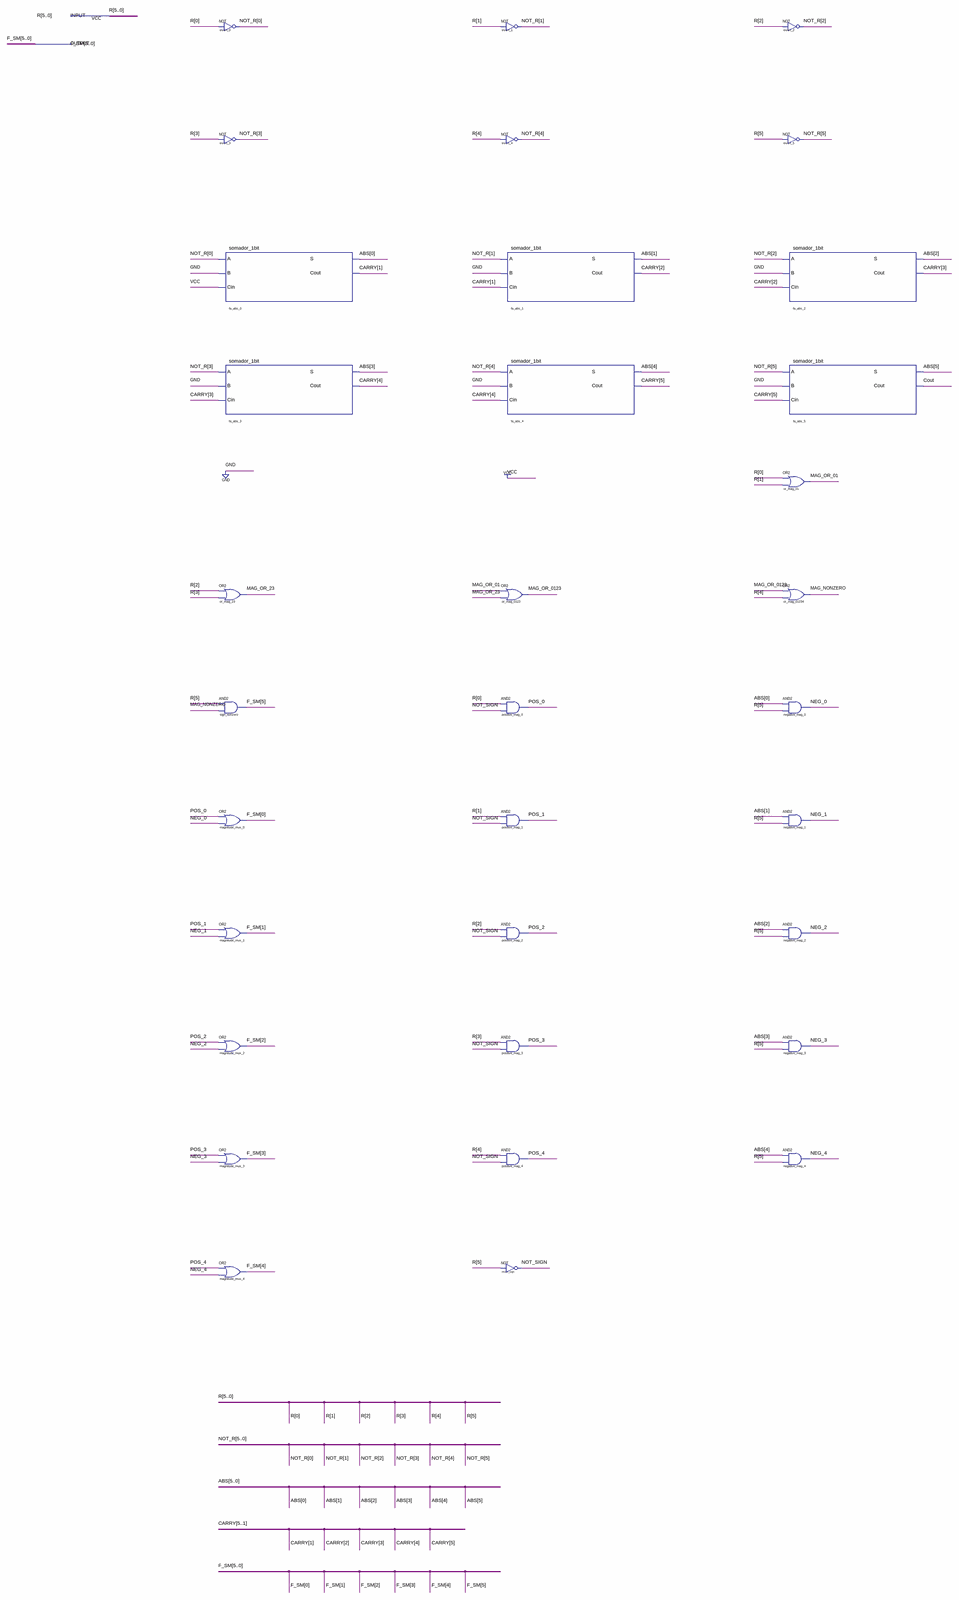
[diagram p0: schematic sheet, whole]
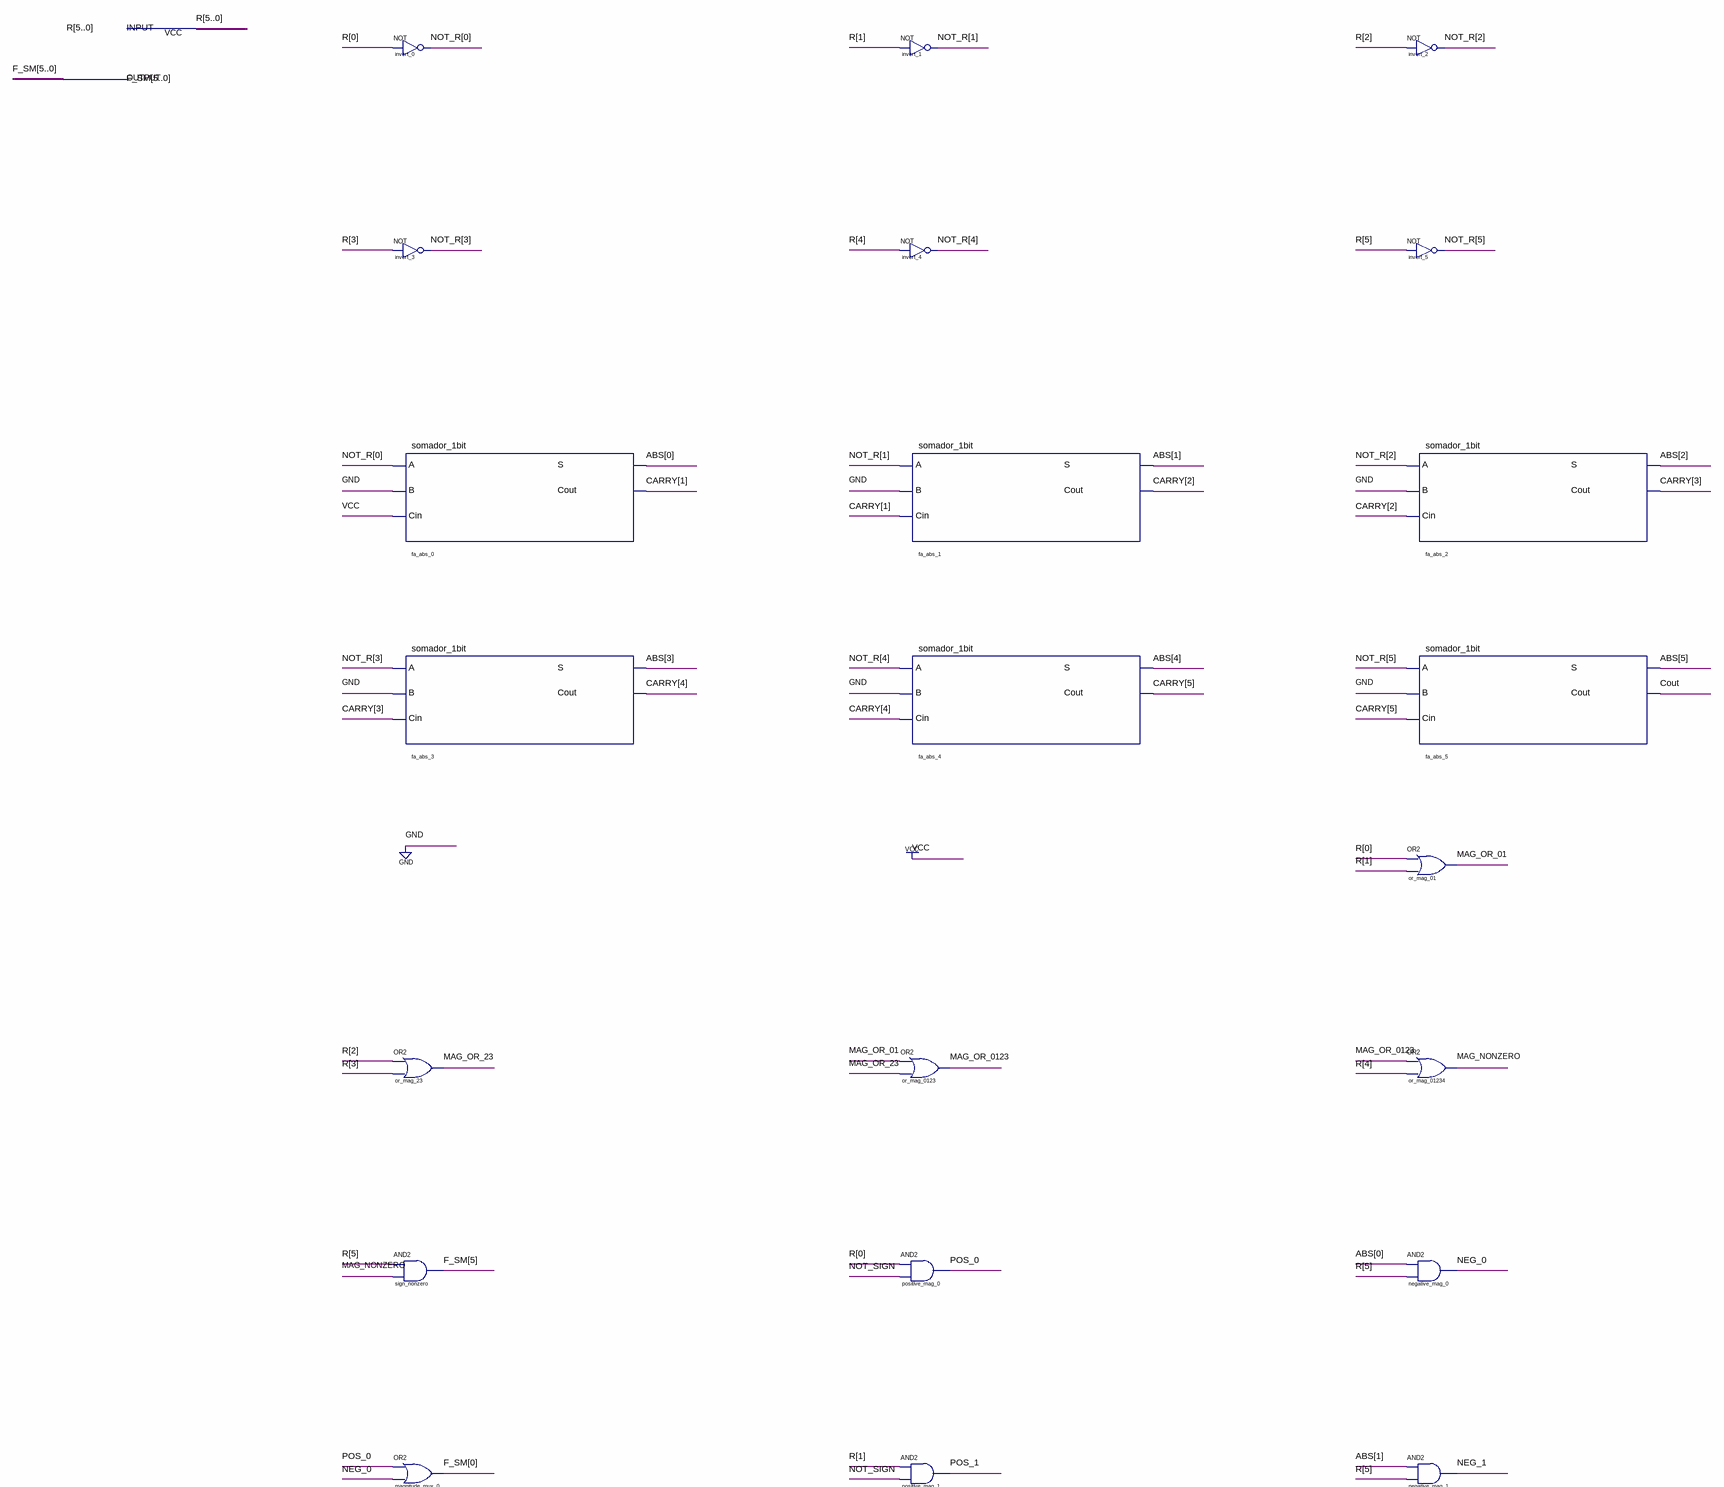
[diagram p1: schematic sheet, upper part]
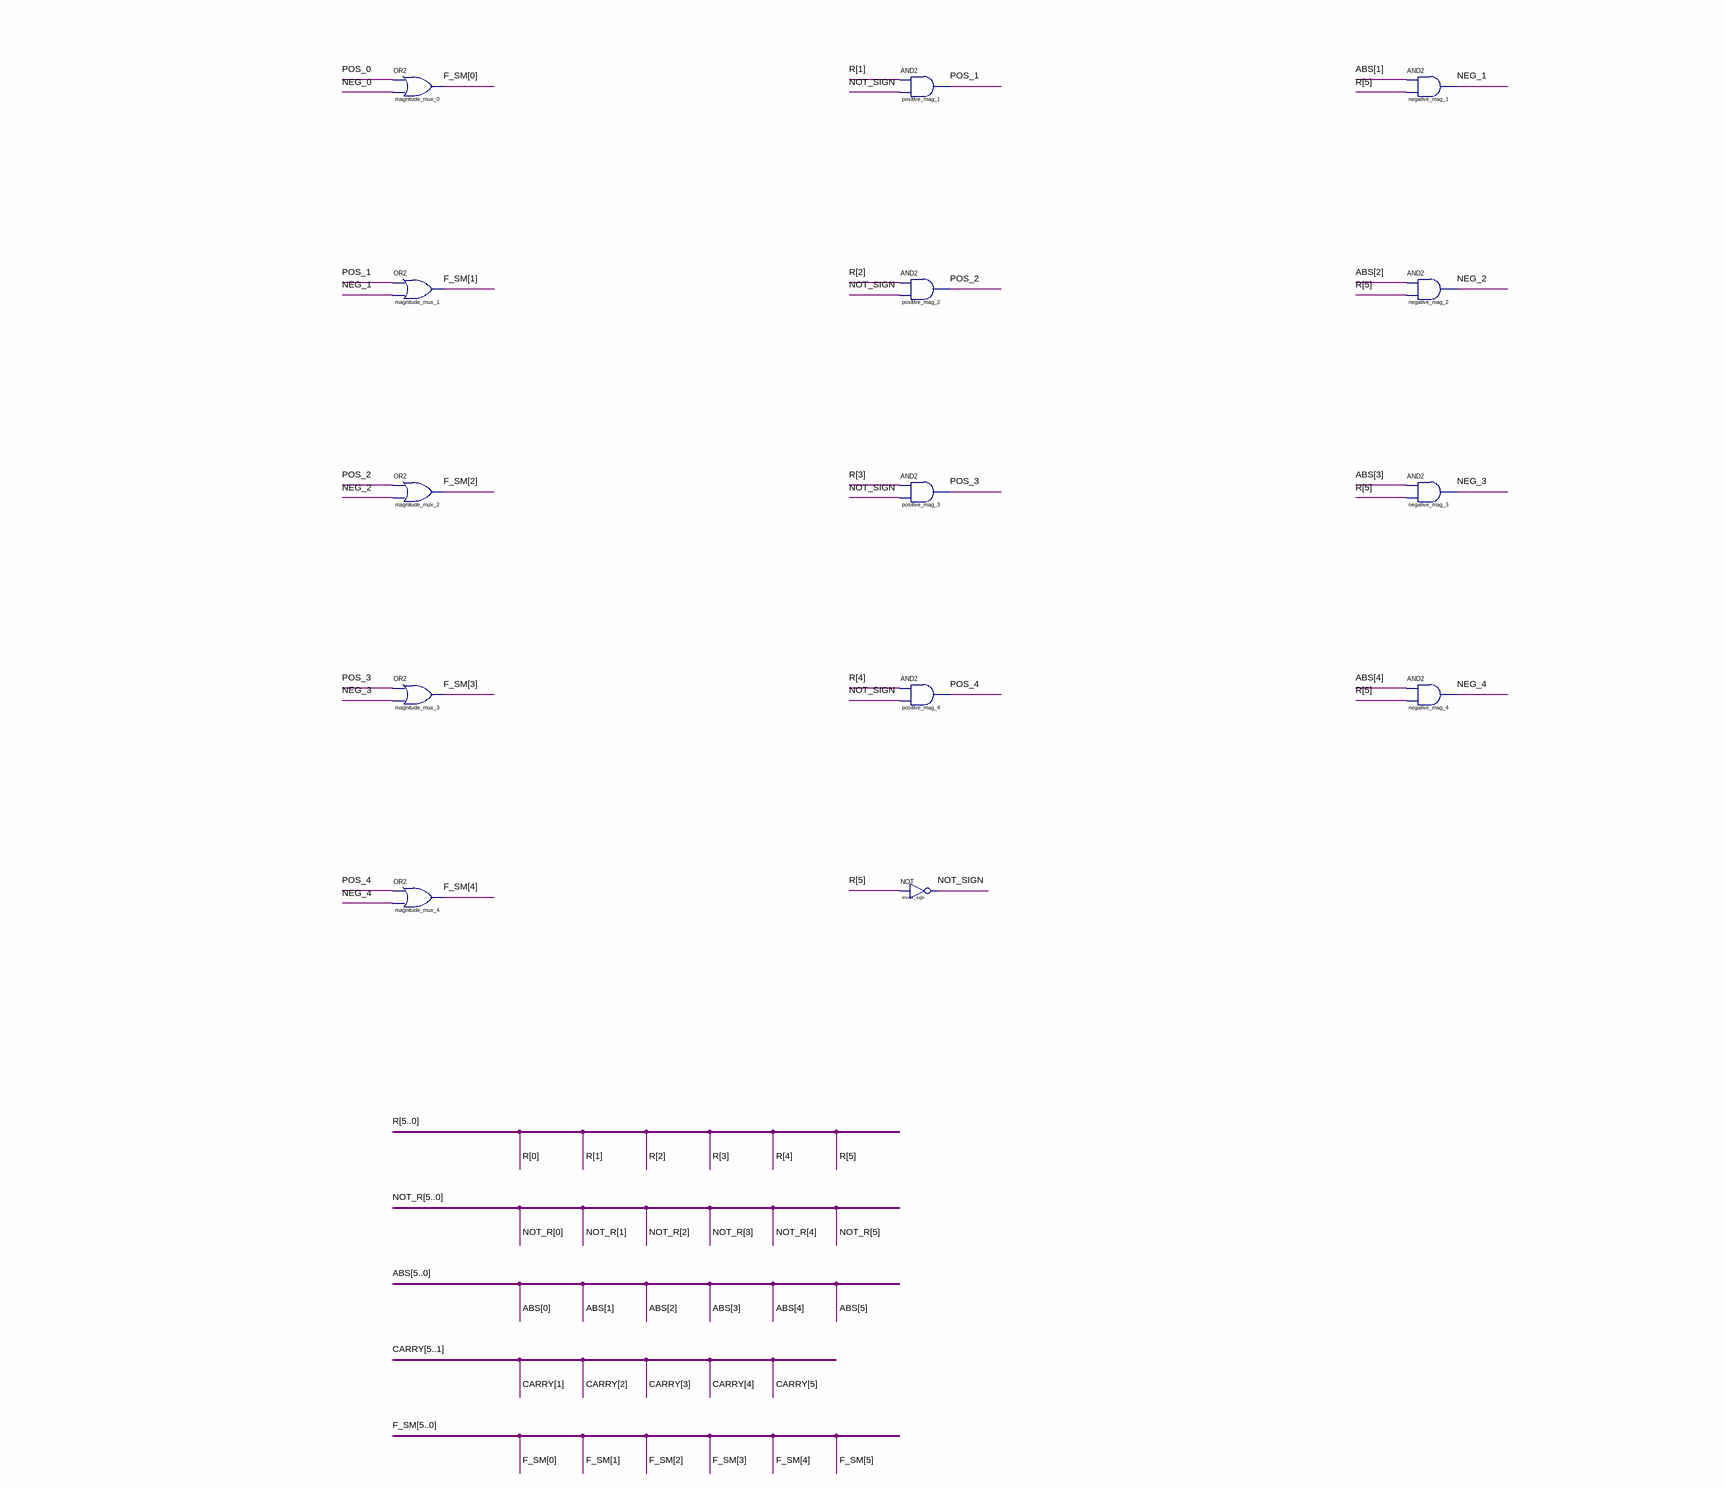
[diagram p2: schematic sheet, lower part]
// Quartus schematic c2_para_sm.bdf as structural Verilog: 33 symbols, 2 pins
module c2_para_sm (
  input  [5:0] R,
  output [5:0] F_SM
);

  wire Cout, MAG_NONZERO, MAG_OR_01, MAG_OR_23, MAG_OR_0123, NEG_0, NEG_1, NEG_2, NEG_3, NEG_4, NOT_SIGN,
       POS_0, POS_1, POS_2, POS_3, POS_4;
  wire [5:0] ABS, NOT_R;
  wire [5:1] CARRY;

  not invert_0 (NOT_R[0], R[0]);
  not invert_3 (NOT_R[3], R[3]);
  somador_1bit fa_abs_0 (.A(NOT_R[0]), .B(1'b0), .Cin(1'b1), .S(ABS[0]), .Cout(CARRY[1]));
  somador_1bit fa_abs_3 (.A(NOT_R[3]), .B(1'b0), .Cin(CARRY[3]), .S(ABS[3]), .Cout(CARRY[4]));
  or or_mag_23 (MAG_OR_23, R[2], R[3]);
  and sign_nonzero (F_SM[5], R[5], MAG_NONZERO);
  or magnitude_mux_0 (F_SM[0], POS_0, NEG_0);
  or magnitude_mux_1 (F_SM[1], POS_1, NEG_1);
  or magnitude_mux_2 (F_SM[2], POS_2, NEG_2);
  or magnitude_mux_3 (F_SM[3], POS_3, NEG_3);
  or magnitude_mux_4 (F_SM[4], POS_4, NEG_4);
  not invert_1 (NOT_R[1], R[1]);
  not invert_4 (NOT_R[4], R[4]);
  somador_1bit fa_abs_1 (.A(NOT_R[1]), .B(1'b0), .Cin(CARRY[1]), .S(ABS[1]), .Cout(CARRY[2]));
  somador_1bit fa_abs_4 (.A(NOT_R[4]), .B(1'b0), .Cin(CARRY[4]), .S(ABS[4]), .Cout(CARRY[5]));
  or or_mag_0123 (MAG_OR_0123, MAG_OR_01, MAG_OR_23);
  and positive_mag_0 (POS_0, R[0], NOT_SIGN);
  and positive_mag_1 (POS_1, R[1], NOT_SIGN);
  and positive_mag_2 (POS_2, R[2], NOT_SIGN);
  and positive_mag_3 (POS_3, R[3], NOT_SIGN);
  and positive_mag_4 (POS_4, R[4], NOT_SIGN);
  not invert_sign (NOT_SIGN, R[5]);
  not invert_2 (NOT_R[2], R[2]);
  not invert_5 (NOT_R[5], R[5]);
  somador_1bit fa_abs_2 (.A(NOT_R[2]), .B(1'b0), .Cin(CARRY[2]), .S(ABS[2]), .Cout(CARRY[3]));
  somador_1bit fa_abs_5 (.A(NOT_R[5]), .B(1'b0), .Cin(CARRY[5]), .S(ABS[5]), .Cout(Cout));
  or or_mag_01 (MAG_OR_01, R[0], R[1]);
  or or_mag_01234 (MAG_NONZERO, MAG_OR_0123, R[4]);
  and negative_mag_0 (NEG_0, ABS[0], R[5]);
  and negative_mag_1 (NEG_1, ABS[1], R[5]);
  and negative_mag_2 (NEG_2, ABS[2], R[5]);
  and negative_mag_3 (NEG_3, ABS[3], R[5]);
  and negative_mag_4 (NEG_4, ABS[4], R[5]);
endmodule
